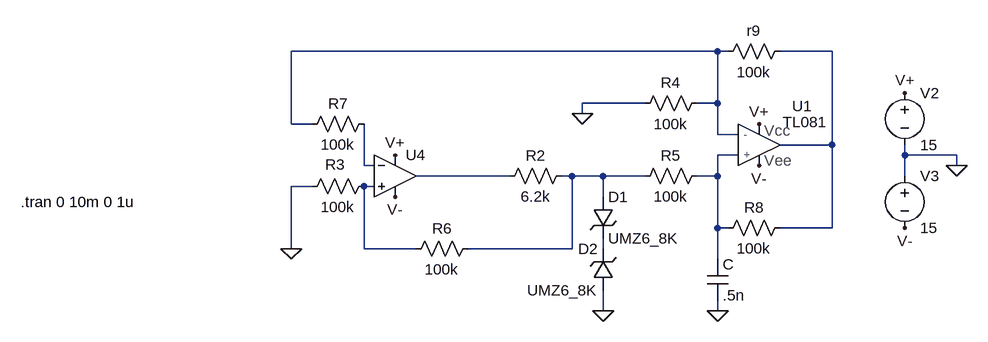
[diagram p0: schematic biestable - limitador - integrador.asc]
biestable - limitador - integrador.asc, the LTspice schematic file:
Version 4
SHEET 1 880 692
WIRE 144 -16 -512 -16
WIRE 160 -16 144 -16
WIRE 320 -16 240 -16
WIRE 32 64 -64 64
WIRE 144 64 144 -16
WIRE 144 64 112 64
WIRE -64 80 -64 64
WIRE -512 96 -512 -16
WIRE -480 96 -512 96
WIRE 144 112 144 64
WIRE 176 112 144 112
WIRE 320 128 320 -16
WIRE 320 128 240 128
WIRE 176 144 144 144
WIRE 432 144 432 128
WIRE 512 144 432 144
WIRE -400 160 -400 96
WIRE -384 160 -400 160
WIRE 512 160 512 144
WIRE -176 176 -320 176
WIRE -80 176 -96 176
WIRE -32 176 -80 176
WIRE 32 176 -32 176
WIRE 144 176 144 144
WIRE 144 176 112 176
WIRE 432 176 432 144
WIRE -480 192 -512 192
WIRE -384 192 -400 192
WIRE -32 208 -32 176
WIRE 144 256 144 176
WIRE 160 256 144 256
WIRE 320 256 320 128
WIRE 320 256 240 256
WIRE -512 288 -512 192
WIRE -400 288 -400 192
WIRE -320 288 -400 288
WIRE -80 288 -80 176
WIRE -80 288 -240 288
WIRE -32 288 -32 272
WIRE 144 304 144 256
WIRE -32 384 -32 352
WIRE 144 384 144 368
FLAG 512 160 0
FLAG 432 48 V+
FLAG 432 256 V-
FLAG 144 384 0
FLAG -64 80 0
FLAG 208 96 V+
FLAG 208 160 V-
FLAG -352 208 V-
FLAG -352 144 V+
FLAG -512 288 0
FLAG -32 384 0
SYMBOL voltage 432 32 R0
WINDOW 123 0 0 Left 0
WINDOW 39 0 0 Left 0
SYMATTR InstName V2
SYMATTR Value 15
SYMBOL voltage 432 160 R0
WINDOW 123 0 0 Left 0
WINDOW 39 0 0 Left 0
SYMATTR InstName V3
SYMATTR Value 15
SYMBOL Agregados\\TL081 208 128 R0
SYMATTR InstName U1
SYMBOL res 256 -32 R90
WINDOW 0 0 56 VBottom 2
WINDOW 3 32 56 VTop 2
SYMATTR InstName r9
SYMATTR Value 100k
SYMBOL res 256 240 R90
WINDOW 0 0 56 VBottom 2
WINDOW 3 32 56 VTop 2
SYMATTR InstName R8
SYMATTR Value 100k
SYMBOL res 128 48 R90
WINDOW 0 0 56 VBottom 2
WINDOW 3 32 56 VTop 2
SYMATTR InstName R4
SYMATTR Value 100k
SYMBOL res 128 160 R90
WINDOW 0 0 56 VBottom 2
WINDOW 3 32 56 VTop 2
SYMATTR InstName R5
SYMATTR Value 100k
SYMBOL cap 128 304 R0
SYMATTR InstName C
SYMATTR Value .5n
SYMBOL res -384 176 R90
WINDOW 0 -2 60 VBottom 2
WINDOW 3 32 56 VTop 2
SYMATTR InstName R3
SYMATTR Value 100k
SYMBOL res -224 272 R90
WINDOW 0 0 56 VBottom 2
WINDOW 3 32 56 VTop 2
SYMATTR InstName R6
SYMATTR Value 100k
SYMBOL res -384 80 R90
WINDOW 0 0 56 VBottom 2
WINDOW 3 32 56 VTop 2
SYMATTR InstName R7
SYMATTR Value 100k
SYMBOL res -80 160 R90
WINDOW 0 0 56 VBottom 2
WINDOW 3 32 56 VTop 2
SYMATTR InstName R2
SYMATTR Value 6.2k
SYMBOL zener -48 208 R0
SYMATTR InstName D1
SYMATTR Value UMZ6_8K
SYMBOL zener -16 352 R180
WINDOW 0 24 64 Left 2
WINDOW 3 24 0 Left 2
SYMATTR InstName D2
SYMATTR Value UMZ6_8K
SYMBOL Opamps\\UniversalOpamp2 -352 176 R0
SYMATTR InstName U4
SYMATTR Value2 Avol=1Meg GBW=1000Meg Slew=1000Meg
TEXT -928 216 Left 2 !.tran 0 10m 0 1u

The netlist it stands for:
* biestable - limitador - integrador.asc
V2 V+ 0 15
V3 0 V- 15
XU1 N003 N001 V+ V- N002 TL081  ; pins + - ? ? ?
r9 N002 N001 100k
R8 N002 N003 100k
R4 N001 0 100k
R5 N003 N006 100k
C N003 0 .5n
R3 N007 0 100k
R6 N006 N007 100k
R7 N004 N001 100k
R2 N006 N005 6.2k
D1 N006 N008 UMZ6_8K
D2 0 N008 UMZ6_8K
XU4 N007 N004 V+ V- N005 level.2 Avol=1Meg GBW=1000Meg Slew=1000Meg ilimit=25m rail=0 Vos=0 phimargin=45 en=0 enk=0 in=0 ink=0 Rin=500Meg  ; pins IN+ IN- V+ V- OUT
.model D D
.lib standard.dio
.tran 0 10m 0 1u
.lib E:\Descargas\TL081.net
.lib UniversalOpamps2.sub
.backanno
.end